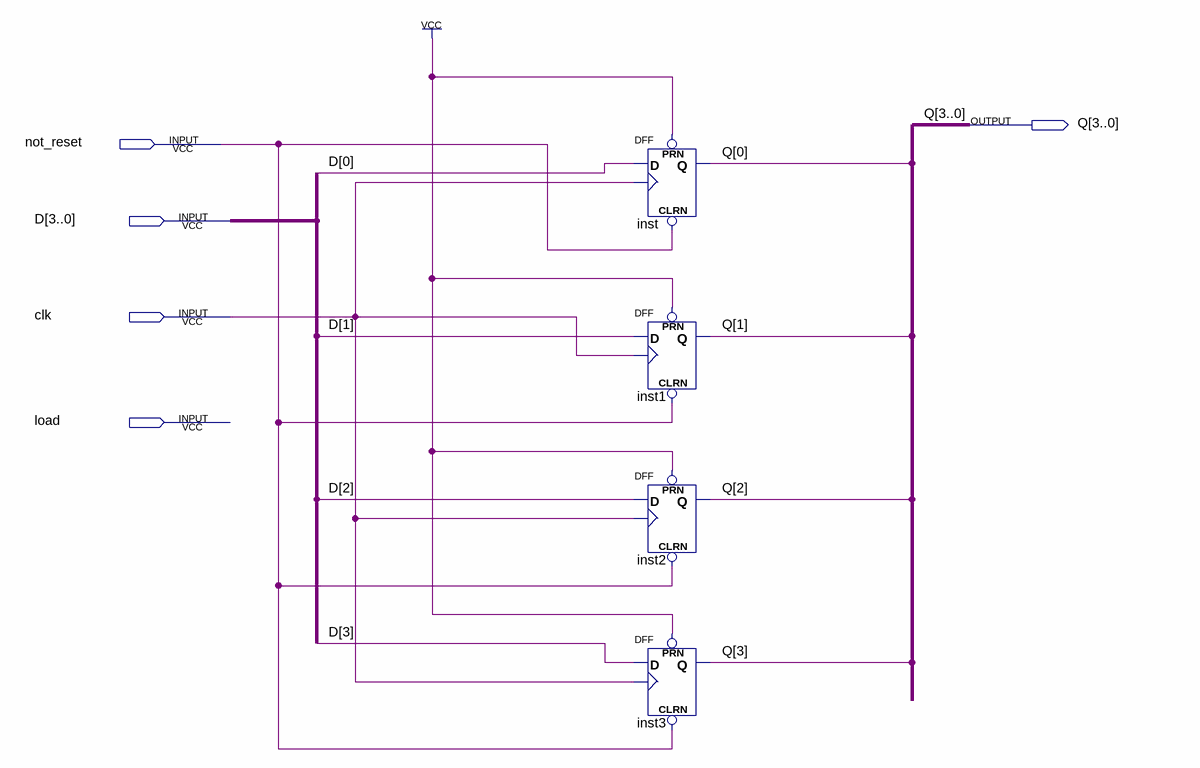
[diagram p0: schematic sheet]
// Quartus schematic register_4bit.bdf as structural Verilog: 4 symbols, 5 pins
module register_4bit (
  input  not_reset,
  input  [3:0] D,
  input  clk,
  input  load,
  output [3:0] Q
);

  DFF inst (.CLRN(not_reset), .CLK(clk), .D(D[0]), .PRN(1'b1), .Q(Q[0]));
  DFF inst1 (.CLRN(not_reset), .CLK(clk), .D(D[1]), .PRN(1'b1), .Q(Q[1]));
  DFF inst2 (.CLRN(not_reset), .CLK(clk), .D(D[2]), .PRN(1'b1), .Q(Q[2]));
  DFF inst3 (.CLRN(not_reset), .CLK(clk), .D(D[3]), .PRN(1'b1), .Q(Q[3]));
endmodule
